# Altium schematic sheet Sensors.SchDoc
size A
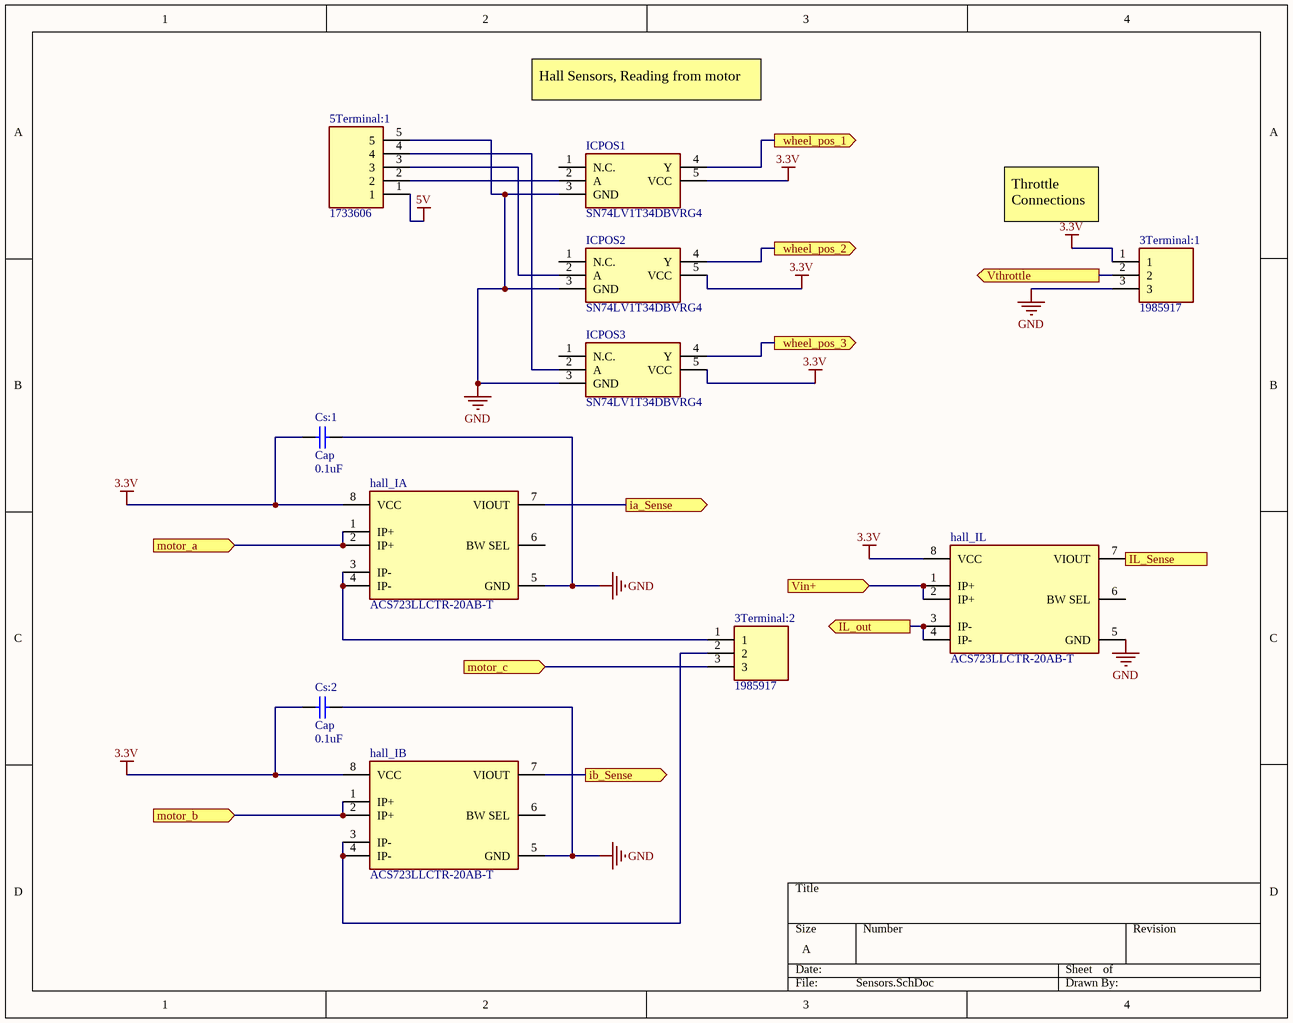
[diagram p0: Sensors.SchDoc]

## Parts
3Terminal:1  1985917  [1985917]
3Terminal:2  1985917  [1985917]
5Terminal:1  1733606  [1733606]
Cs:1  Cap  value 0.1uF  [RAD-0.3]
Cs:2  Cap  value 0.1uF  [RAD-0.3]
hall_IA  ACS723LLCTR-20AB-T  [FP-LC-8-IPC_C]
hall_IB  ACS723LLCTR-20AB-T  [FP-LC-8-IPC_C]
hall_IL  ACS723LLCTR-20AB-T  [FP-LC-8-IPC_C]
ICPOS1  SN74LV1T34DBVRG4  [SOT95P280X145-5N]
ICPOS2  SN74LV1T34DBVRG4  [SOT95P280X145-5N]
ICPOS3  SN74LV1T34DBVRG4  [SOT95P280X145-5N]

## Ports
ia_Sense (out), ib_Sense (out), IL_out (out), IL_Sense (out), motor_a (in), motor_b (in), motor_c (in), Vin+ (in), Vthrottle (out), wheel_pos_1 (out), wheel_pos_2 (out), wheel_pos_3 (out)

## Nets
3.3V: 3Terminal:1.1 Cs:1.1 Cs:2.1 hall_IA.8(VCC) hall_IB.8(VCC) hall_IL.8(VCC) ICPOS1.5(VCC) ICPOS2.5(VCC) ICPOS3.5(VCC)
5V: 5Terminal:1.1
GND: 3Terminal:1.3 5Terminal:1.5 Cs:1.2 Cs:2.2 hall_IA.5(GND) hall_IB.5(GND) hall_IL.5(GND) ICPOS1.3(GND) ICPOS2.3(GND) ICPOS3.3(GND)
ia_Sense: hall_IA.7(VIOUT) ; port ia_Sense
ib_Sense: hall_IB.7(VIOUT) ; port ib_Sense
IL_out: hall_IL.3(IP-) hall_IL.4(IP-) ; port IL_out
IL_Sense: hall_IL.7(VIOUT) ; port IL_Sense
motor_a: hall_IA.1(IP+) hall_IA.2(IP+) ; port motor_a
motor_b: hall_IB.1(IP+) hall_IB.2(IP+) ; port motor_b
motor_c: 3Terminal:2.3 ; port motor_c
Vin+: hall_IL.1(IP+) hall_IL.2(IP+) ; port Vin+
Vthrottle: 3Terminal:1.2 ; port Vthrottle
wheel_pos_1: ICPOS1.4(Y) ; port wheel_pos_1
wheel_pos_2: ICPOS2.4(Y) ; port wheel_pos_2
wheel_pos_3: ICPOS3.4(Y) ; port wheel_pos_3
Net3Terminal:2_1: 3Terminal:2.1 hall_IA.3(IP-) hall_IA.4(IP-)
Net3Terminal:2_2: 3Terminal:2.2 hall_IB.3(IP-) hall_IB.4(IP-)
Net5Terminal:1_2: 5Terminal:1.2 ICPOS1.2(A)
Net5Terminal:1_3: 5Terminal:1.3 ICPOS2.2(A)
Net5Terminal:1_4: 5Terminal:1.4 ICPOS3.2(A)

Not connected (* = marked no-connect by the designer): hall_IA 6(BW_SEL); hall_IB 6(BW_SEL); hall_IL 6(BW_SEL); ICPOS1 1(N.C.); ICPOS2 1(N.C.); ICPOS3 1(N.C.)

## Notes on the sheet
- Hall Sensors, Reading from motor
- Throttle Connections

## Library data of the parts
3Terminal:1 3Terminal:2 = 1985917: Connector; Manufacturer_Name: Phoenix Contact; Datasheet Link: https://media.digikey.com/pdf/Data%20Sheets/Phoenix%20Contact%20PDFs/Multi-Postion%20PCTerminal%20Blocks.pdf; Height: 13.95mm; Manufacturer_Part_Number: 1985917; Mouser Part Number: 651-1985917; Mouser Price/Stock: https://www.mouser.co.uk/ProductDetail/Phoenix-Contact/1985917/?qs=ibOxrZ%2Fd8eDdpJplVMXgvQ%3D%3D; Arrow Part Number: 1985917; Arrow Price/Stock: https://www.arrow.com/en/products/1985917/phoenix-contact
5Terminal:1 = 1733606: Connector; Manufacturer_Name: Phoenix Contact; Datasheet Link: https://www.phoenixcontact.com/online/portal/us?uri=pxc-oc-itemdetail:pid=1733606&library=usen&tab=1; Height: 15.45mm; Manufacturer_Part_Number: 1733606; Mouser Part Number: 651-1733606; Mouser Price/Stock: https://www.mouser.co.uk/ProductDetail/Phoenix-Contact/1733606/?qs=coeDwHeOZKnxpzvXWWKBZQ%3D%3D; Arrow Part Number: 1733606; Arrow Price/Stock: https://www.arrow.com/en/products/1733606/phoenix-contact
Cs:1 Cs:2 = Cap: Capacitor; Published: 8-Jun-2000; LatestRevisionDate: 17-Jul-2002; LatestRevisionNote: Re-released for DXP Platform.; PackageReference: RAD-0.3; Publisher: Altium Limited; PackageDescription: Radial Cap, Thru-Hole; 2 Leads; 0.3 in Pin Spacing
hall_IA hall_IB hall_IL = CMP-82923-000025-1: SENSOR CURRENT HALL 20A AC/DC; Number of Channels: 1; Max Input Voltage: 5.5V; Polarity: Bidirectional; Sensitivity: 100mV/A; Max Supply Current: 14mA; Frequency: 80kHz; Linearity: 1%; Response Time: 5us; Min Input Voltage: 4.5V; Accuracy: 3%; Mount: Surface Mount; Length: 4.9mm; Packaging: Tape and Reel; Height: 1.5mm; Current Sensing: 20A; RoHS Compliant: Yes; Number of Pins: 8; Max Operating Temperature: 150°C; Width: 3.9mm; Case/Package: SOIC; Min Operating Temperature: -40°C
ICPOS1-ICPOS3 = SN74LV1T34DBVRG4: Integrated Circuit; Manufacturer_Name: Texas Instruments; Datasheet Link: http://www.ti.com/lit/gpn/sn74lv1t34; Height: 1.45mm; Manufacturer_Part_Number: SN74LV1T34DBVRG4; Mouser Part Number: 595-SN74LV1T34DBVRG4; Mouser Price/Stock: https://www.mouser.co.uk/ProductDetail/Texas-Instruments/SN74LV1T34DBVRG4?qs=vdi0iO8H4N10R%252Bt%252BjmxZrg%3D%3D; Arrow Part Number: SN74LV1T34DBVRG4; Arrow Price/Stock: https://www.arrow.com/en/products/sn74lv1t34dbvrg4/texas-instruments